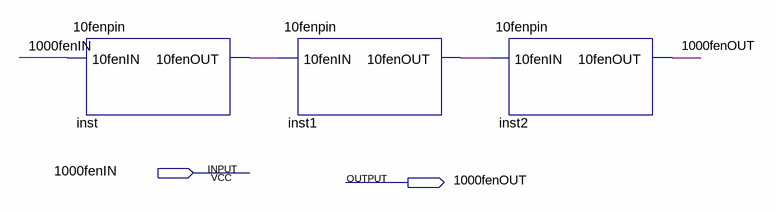
[diagram p0: schematic sheet]
// Quartus schematic 1000fenpin.bdf as structural Verilog: 3 symbols, 2 pins
module \1000fenpin  (
  input  \1000fenIN ,
  output \1000fenOUT 
);

  wire inst1_10fenout, inst_10fenout;

  \10fenpin  inst (.\10fenIN (\1000fenIN ), .\10fenOUT (inst_10fenout));
  \10fenpin  inst1 (.\10fenIN (inst_10fenout), .\10fenOUT (inst1_10fenout));
  \10fenpin  inst2 (.\10fenIN (inst1_10fenout), .\10fenOUT (\1000fenOUT ));
endmodule
